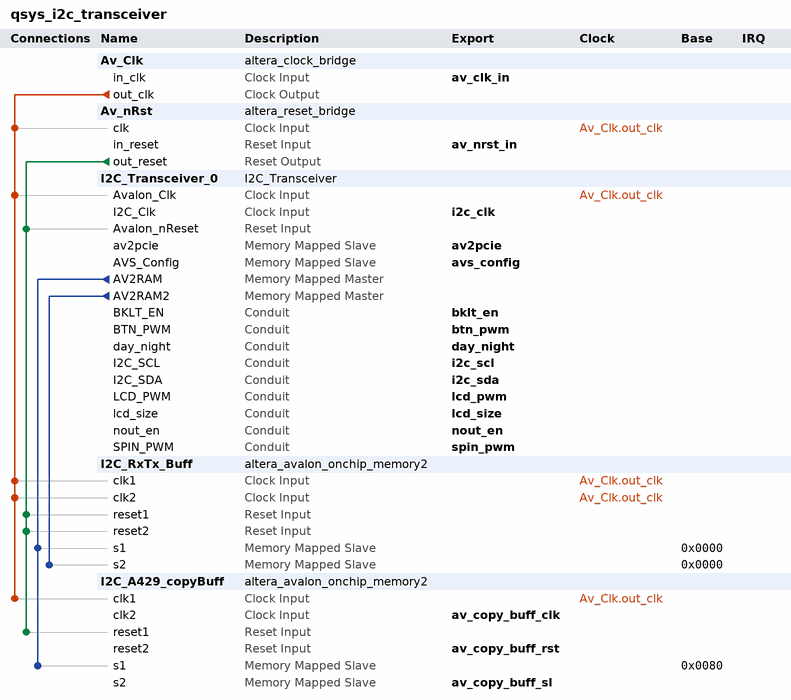
[diagram p0: system contents]
# Platform Designer (Qsys) system qsys_i2c_transceiver, Cyclone V 5CGXFC7D6F31I7
# Parameters at their usual value, and those the tool derives, are not listed.
package require -exact qsys 20.1
create_system qsys_i2c_transceiver
set_project_property DEVICE_FAMILY {Cyclone V}
set_project_property DEVICE 5CGXFC7D6F31I7

add_instance Av_Clk altera_clock_bridge 20.1
set_instance_parameter_value Av_Clk DERIVED_CLOCK_RATE 0
set_instance_parameter_value Av_Clk EXPLICIT_CLOCK_RATE 0

add_instance Av_nRst altera_reset_bridge 20.1
set_instance_parameter_value Av_nRst ACTIVE_LOW_RESET 1
set_instance_parameter_value Av_nRst SYNCHRONOUS_EDGES deassert

add_instance I2C_Transceiver_0 I2C_Transceiver 16.1

add_instance I2C_RxTx_Buff altera_avalon_onchip_memory2 20.1
set_instance_parameter_value I2C_RxTx_Buff dataWidth 32
set_instance_parameter_value I2C_RxTx_Buff dualPort true
set_instance_parameter_value I2C_RxTx_Buff initMemContent true
set_instance_parameter_value I2C_RxTx_Buff initializationFileName onchip_mem.hex
set_instance_parameter_value I2C_RxTx_Buff memorySize 128

add_instance I2C_A429_copyBuff altera_avalon_onchip_memory2 20.1
set_instance_parameter_value I2C_A429_copyBuff dataWidth 32
set_instance_parameter_value I2C_A429_copyBuff dualPort true
set_instance_parameter_value I2C_A429_copyBuff initMemContent false
set_instance_parameter_value I2C_A429_copyBuff initializationFileName onchip_mem.hex
set_instance_parameter_value I2C_A429_copyBuff memorySize 64

# connections
add_connection Av_Clk.out_clk Av_nRst.clk clock
add_connection Av_Clk.out_clk I2C_A429_copyBuff.clk1 clock
add_connection Av_Clk.out_clk I2C_RxTx_Buff.clk1 clock
add_connection Av_Clk.out_clk I2C_RxTx_Buff.clk2 clock
add_connection Av_Clk.out_clk I2C_Transceiver_0.Avalon_Clk clock
add_connection Av_nRst.out_reset I2C_A429_copyBuff.reset1 reset
add_connection Av_nRst.out_reset I2C_RxTx_Buff.reset1 reset
add_connection Av_nRst.out_reset I2C_RxTx_Buff.reset2 reset
add_connection Av_nRst.out_reset I2C_Transceiver_0.Avalon_nReset reset
add_connection I2C_Transceiver_0.AV2RAM I2C_A429_copyBuff.s1 avalon
set_connection_parameter_value I2C_Transceiver_0.AV2RAM/I2C_A429_copyBuff.s1 baseAddress 0x0080
add_connection I2C_Transceiver_0.AV2RAM I2C_RxTx_Buff.s1 avalon
set_connection_parameter_value I2C_Transceiver_0.AV2RAM/I2C_RxTx_Buff.s1 baseAddress 0x0000
add_connection I2C_Transceiver_0.AV2RAM2 I2C_RxTx_Buff.s2 avalon
set_connection_parameter_value I2C_Transceiver_0.AV2RAM2/I2C_RxTx_Buff.s2 baseAddress 0x0000

# exported interfaces
add_interface av2pcie avalon slave
set_interface_property av2pcie EXPORT_OF I2C_Transceiver_0.av2pcie
add_interface av_clk_in clock sink
set_interface_property av_clk_in EXPORT_OF Av_Clk.in_clk
add_interface av_copy_buff_clk clock sink
set_interface_property av_copy_buff_clk EXPORT_OF I2C_A429_copyBuff.clk2
add_interface av_copy_buff_rst reset sink
set_interface_property av_copy_buff_rst EXPORT_OF I2C_A429_copyBuff.reset2
add_interface av_copy_buff_sl avalon slave
set_interface_property av_copy_buff_sl EXPORT_OF I2C_A429_copyBuff.s2
add_interface av_nrst_in reset sink
set_interface_property av_nrst_in EXPORT_OF Av_nRst.in_reset
add_interface avs_config avalon slave
set_interface_property avs_config EXPORT_OF I2C_Transceiver_0.AVS_Config
add_interface bklt_en conduit end
set_interface_property bklt_en EXPORT_OF I2C_Transceiver_0.BKLT_EN
add_interface btn_pwm conduit end
set_interface_property btn_pwm EXPORT_OF I2C_Transceiver_0.BTN_PWM
add_interface day_night conduit end
set_interface_property day_night EXPORT_OF I2C_Transceiver_0.day_night
add_interface i2c_clk clock sink
set_interface_property i2c_clk EXPORT_OF I2C_Transceiver_0.I2C_Clk
add_interface i2c_scl conduit end
set_interface_property i2c_scl EXPORT_OF I2C_Transceiver_0.I2C_SCL
add_interface i2c_sda conduit end
set_interface_property i2c_sda EXPORT_OF I2C_Transceiver_0.I2C_SDA
add_interface lcd_pwm conduit end
set_interface_property lcd_pwm EXPORT_OF I2C_Transceiver_0.LCD_PWM
add_interface lcd_size conduit end
set_interface_property lcd_size EXPORT_OF I2C_Transceiver_0.lcd_size
add_interface nout_en conduit end
set_interface_property nout_en EXPORT_OF I2C_Transceiver_0.nout_en
add_interface spin_pwm conduit end
set_interface_property spin_pwm EXPORT_OF I2C_Transceiver_0.SPIN_PWM

set_interconnect_requirement {$system} qsys_mm.clockCrossingAdapter HANDSHAKE
set_interconnect_requirement {$system} qsys_mm.enableEccProtection FALSE
set_interconnect_requirement {$system} qsys_mm.insertDefaultSlave FALSE
set_interconnect_requirement {$system} qsys_mm.maxAdditionalLatency 1

save_system qsys_i2c_transceiver.qsys
